# EAGLE design VIC20_SExpII (EAGLE 9.6.2)
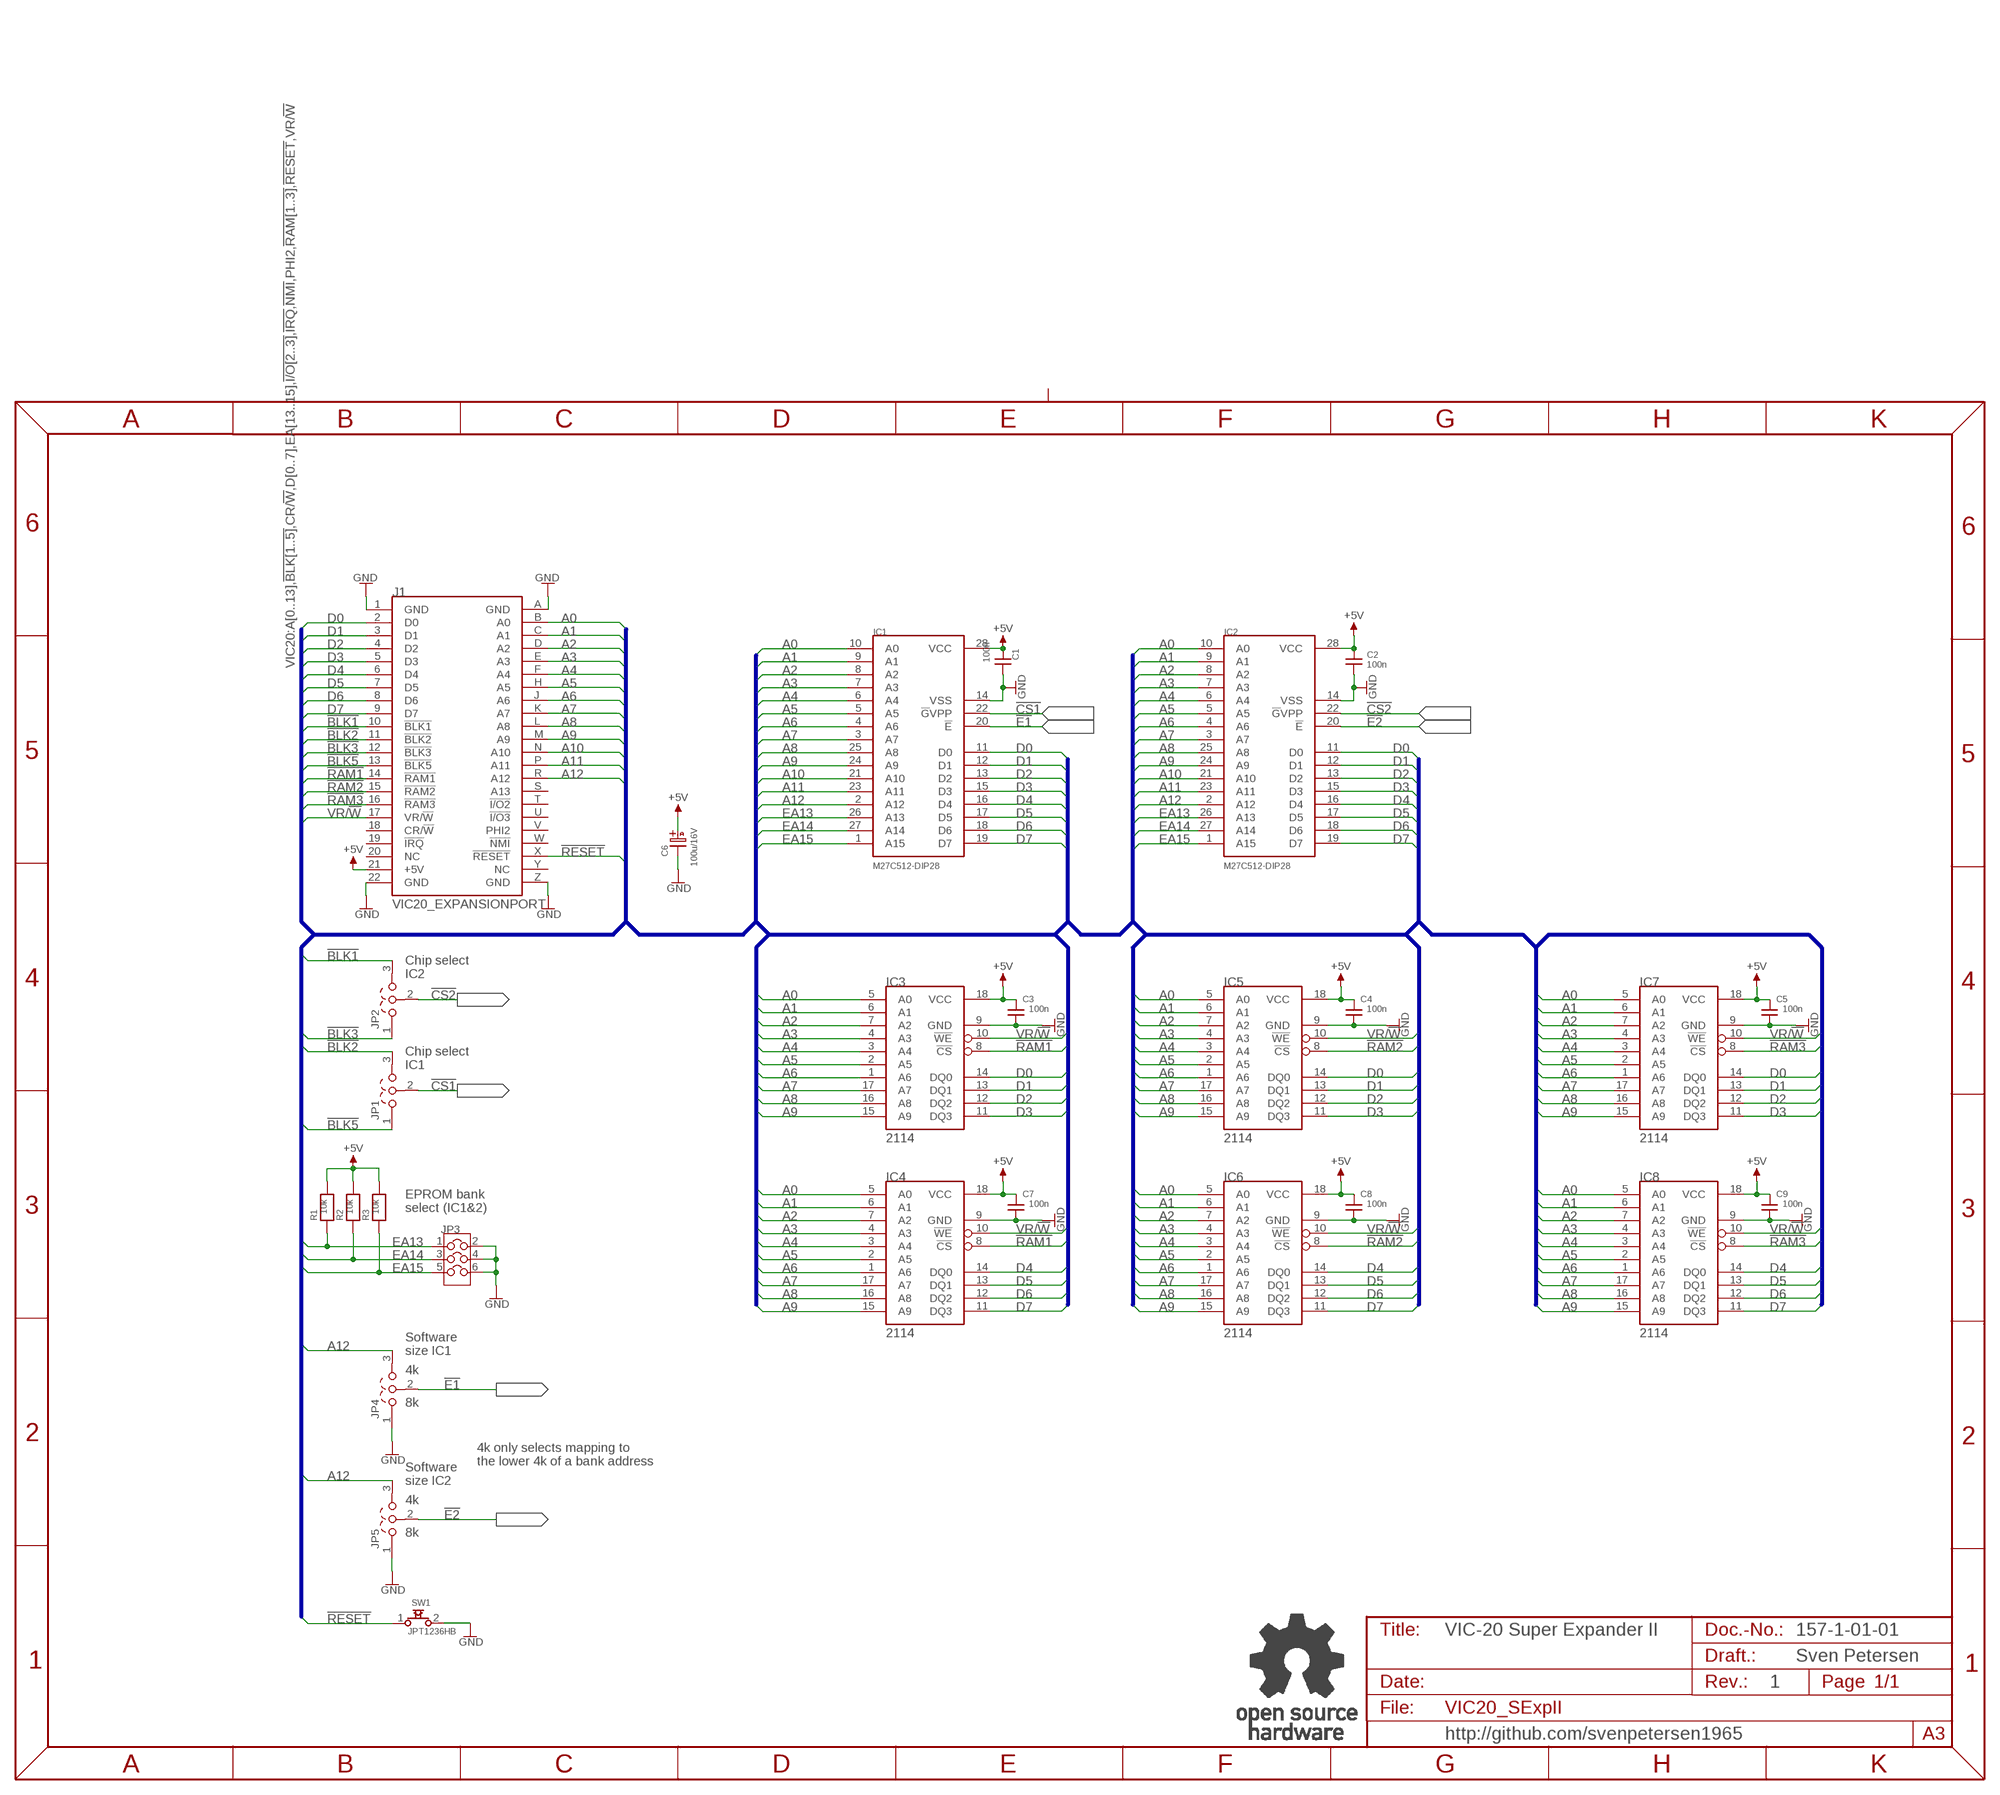
[diagram p0: schematic, sheet 1]

## Parts
C1  100n  CAP01  [C-2,5]
C2  100n  CAP01  [C-2,5]
C3  100n  CAP01  [C-2,5]
C4  100n  CAP01  [C-2,5]
C5  100n  CAP01  [C-2,5]
C6  100u/16V  C07/2,5  [C07/2,5]
C7  100n  CAP01  [C-2,5]
C8  100n  CAP01  [C-2,5]
C9  100n  CAP01  [C-2,5]
IC1  M27C512-DIP28  [DIL28-6]
IC2  M27C512-DIP28  [DIL28-6]
IC3  2114  [DIL18]
IC4  2114  [DIL18]
IC5  2114  [DIL18]
IC6  2114  [DIL18]
IC7  2114  [DIL18]
IC8  2114  [DIL18]
J1  VIC20_EXPANSIONPORT  [VIC20_EXPANSION]
JP1  COMBI-3P  [COMBI-3P]
JP2  COMBI-3P  [COMBI-3P]
JP3  COMBI-3X2P  [COMBI-3X2]
JP4  COMBI-3P  [COMBI-3P]
JP5  COMBI-3P  [COMBI-3P]
R1  10k  RES04  [R-10]
R2  10k  RES04  [R-10]
R3  10k  RES04  [R-10]
SW1  JPT1236HB  [JTP_1236HB]
U$2  OPEN_SOURCE_HW  [OPENHW]

## Nets
!BLK1: J1.10(!BLK1) JP2.3
!BLK2: J1.11(!BLK2) JP1.3
!BLK3: J1.12(!BLK3) JP2.1
!BLK5: J1.13(!BLK5) JP1.1
!CS1: IC1.22(!G!VPP) JP1.2
!CS2: IC2.22(!G!VPP) JP2.2
!E1: IC1.20(!E) JP4.2
!E2: IC2.20(!E) JP5.2
!RAM1: IC3.8(!CS) IC4.8(!CS) J1.14(!RAM1)
!RAM2: IC5.8(!CS) IC6.8(!CS) J1.15(!RAM2)
!RAM3: IC7.8(!CS) IC8.8(!CS) J1.16(!RAM3)
!RESET: J1.X(!RESET) SW1.1
+5V: C1.1 C2.1 C3.2 C4.2 C5.2 C6.A(+) C7.2 C8.2 C9.2 IC1.28(VCC) IC2.28(VCC) IC3.18(VCC) IC4.18(VCC) IC5.18(VCC) IC6.18(VCC) IC7.18(VCC) IC8.18(VCC) J1.21(+5V) R1.2 R2.2 R3.2
A0: IC1.10(A0) IC2.10(A0) IC3.5(A0) IC4.5(A0) IC5.5(A0) IC6.5(A0) IC7.5(A0) IC8.5(A0) J1.B(A0)
A1: IC1.9(A1) IC2.9(A1) IC3.6(A1) IC4.6(A1) IC5.6(A1) IC6.6(A1) IC7.6(A1) IC8.6(A1) J1.C(A1)
A2: IC1.8(A2) IC2.8(A2) IC3.7(A2) IC4.7(A2) IC5.7(A2) IC6.7(A2) IC7.7(A2) IC8.7(A2) J1.D(A2)
A3: IC1.7(A3) IC2.7(A3) IC3.4(A3) IC4.4(A3) IC5.4(A3) IC6.4(A3) IC7.4(A3) IC8.4(A3) J1.E(A3)
A4: IC1.6(A4) IC2.6(A4) IC3.3(A4) IC4.3(A4) IC5.3(A4) IC6.3(A4) IC7.3(A4) IC8.3(A4) J1.F(A4)
A5: IC1.5(A5) IC2.5(A5) IC3.2(A5) IC4.2(A5) IC5.2(A5) IC6.2(A5) IC7.2(A5) IC8.2(A5) J1.H(A5)
A6: IC1.4(A6) IC2.4(A6) IC3.1(A6) IC4.1(A6) IC5.1(A6) IC6.1(A6) IC7.1(A6) IC8.1(A6) J1.J(A6)
A7: IC1.3(A7) IC2.3(A7) IC3.17(A7) IC4.17(A7) IC5.17(A7) IC6.17(A7) IC7.17(A7) IC8.17(A7) J1.K(A7)
A8: IC1.25(A8) IC2.25(A8) IC3.16(A8) IC4.16(A8) IC5.16(A8) IC6.16(A8) IC7.16(A8) IC8.16(A8) J1.L(A8)
A9: IC1.24(A9) IC2.24(A9) IC3.15(A9) IC4.15(A9) IC5.15(A9) IC6.15(A9) IC7.15(A9) IC8.15(A9) J1.M(A9)
A10: IC1.21(A10) IC2.21(A10) J1.N(A10)
A11: IC1.23(A11) IC2.23(A11) J1.P(A11)
A12: IC1.2(A12) IC2.2(A12) J1.R(A12) JP4.3 JP5.3
D0: IC1.11(D0) IC2.11(D0) IC3.14(DQ0) IC5.14(DQ0) IC7.14(DQ0) J1.2(D0)
D1: IC1.12(D1) IC2.12(D1) IC3.13(DQ1) IC5.13(DQ1) IC7.13(DQ1) J1.3(D1)
D2: IC1.13(D2) IC2.13(D2) IC3.12(DQ2) IC5.12(DQ2) IC7.12(DQ2) J1.4(D2)
D3: IC1.15(D3) IC2.15(D3) IC3.11(DQ3) IC5.11(DQ3) IC7.11(DQ3) J1.5(D3)
D4: IC1.16(D4) IC2.16(D4) IC4.14(DQ0) IC6.14(DQ0) IC8.14(DQ0) J1.6(D4)
D5: IC1.17(D5) IC2.17(D5) IC4.13(DQ1) IC6.13(DQ1) IC8.13(DQ1) J1.7(D5)
D6: IC1.18(D6) IC2.18(D6) IC4.12(DQ2) IC6.12(DQ2) IC8.12(DQ2) J1.8(D6)
D7: IC1.19(D7) IC2.19(D7) IC4.11(DQ3) IC6.11(DQ3) IC8.11(DQ3) J1.9(D7)
EA13: IC1.26(A13) IC2.26(A13) JP3.1 R1.1
EA14: IC1.27(A14) IC2.27(A14) JP3.3 R2.1
EA15: IC1.1(A15) IC2.1(A15) JP3.5 R3.1
GND: C1.2 C2.2 C3.1 C4.1 C5.1 C6.K(-) C7.1 C8.1 C9.1 IC1.14(VSS) IC2.14(VSS) IC3.9(GND) IC4.9(GND) IC5.9(GND) IC6.9(GND) IC7.9(GND) IC8.9(GND) J1.1(GND) J1.22(GND) J1.A(GND) J1.Z(GND) JP3.2 JP3.4 JP3.6 JP4.1 JP5.1 SW1.2
VR/!W: IC3.10(!WE) IC4.10(!WE) IC5.10(!WE) IC6.10(!WE) IC7.10(!WE) IC8.10(!WE) J1.17(VR/!W)
Unconnected: J1.18(CR/!W) J1.19(!IRQ) J1.S(A13) J1.T(!I/O2) J1.U(!I/O3) J1.V(PHI2) J1.W(!NMI) J1.Y(NC)

## Buses
VIC20:A[0..13],!BLK[1..5],CR/!W,D[0..7],EA[13..15],!I/O[2..3],!IRQ,!NMI,PHI2,!RAM[1..3],!RESET,VR/!W

## Notes on the sheet
- Chip select
  IC2
- Chip select
  IC1
- EPROM bank
  select (IC1&2)
- Software
  size IC1
- 4k
- 8k
- 4k only selects mapping to
  the lower 4k of a bank address
- Software
  size IC2
- 4k
- 8k
- VIC-20 Super Expander II | 157-1-01-01
- Sven Petersen
- 1
- http://github.com/svenpetersen1965

## Power pins joined to a net without a drawn wire
NC: J1.20(NC)

## Library data of the parts
C1-C5 C7-C9 = DISCRETE:CAP01
C6 = ELCO:C07/2,5
IC1 IC2 = ST:M27C512
IC3-IC8 = MOS:2114
J1 = Commodore:VIC20_EXPANSIONPORT
JP1 JP2 JP4 JP5 = Cutpad:COMBI-3P
JP3 = Cutpad:COMBI-3X2P
R1-R3 = DISCRETE:RES04
SW1 = Namae_Electronics:JPT1236HB
U$2 = Logo:OPEN_SOURCE_HW

## Board
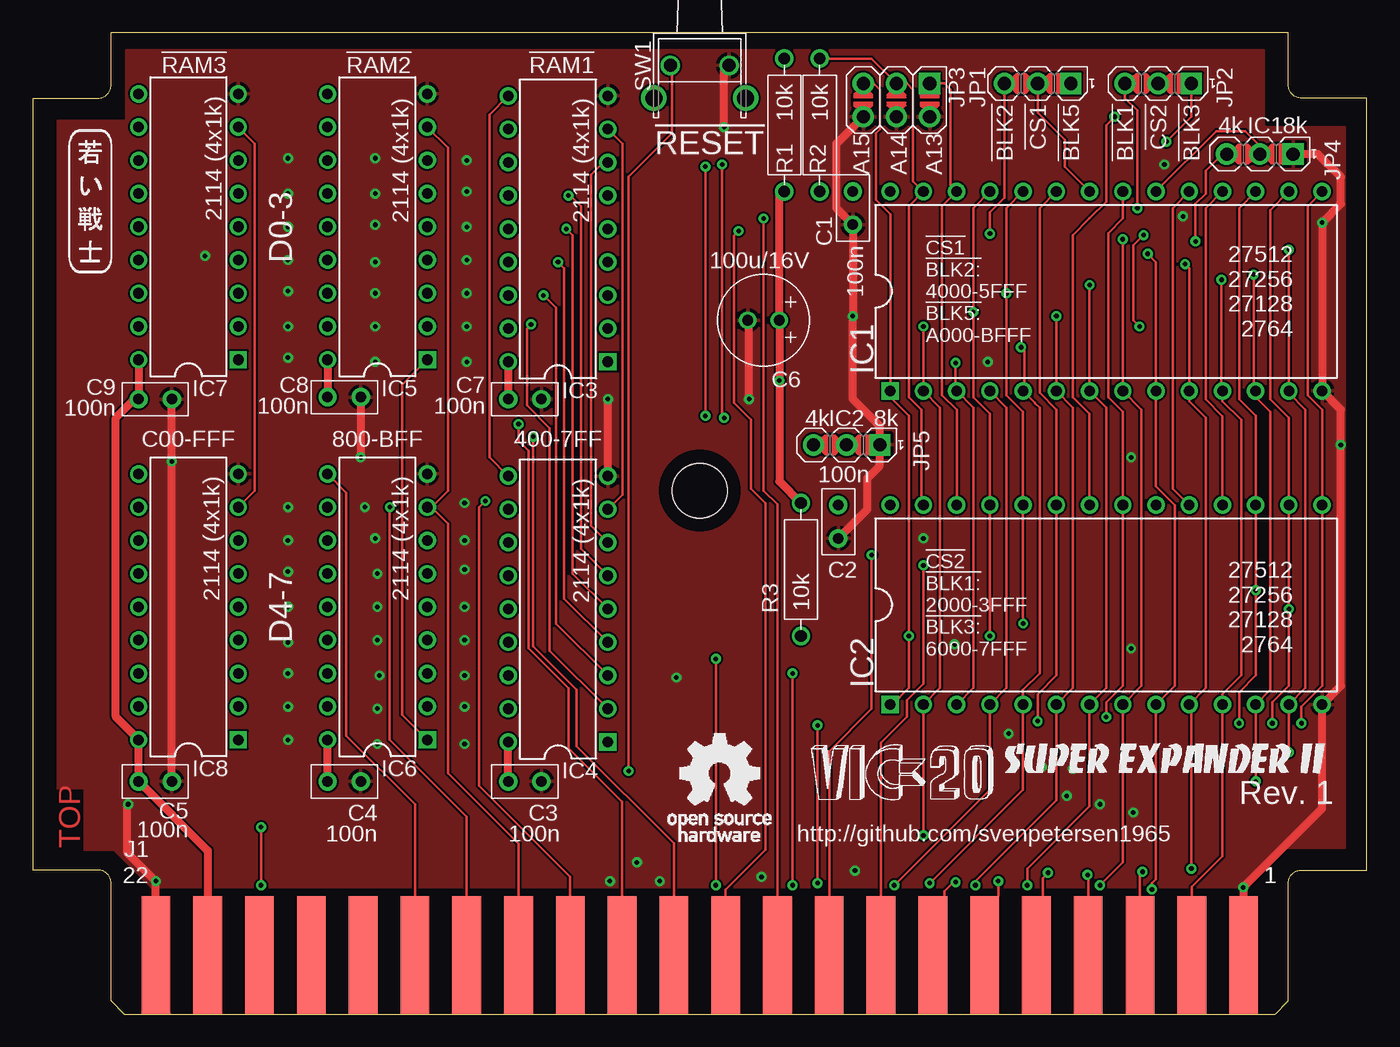
[diagram p1: board, top side]
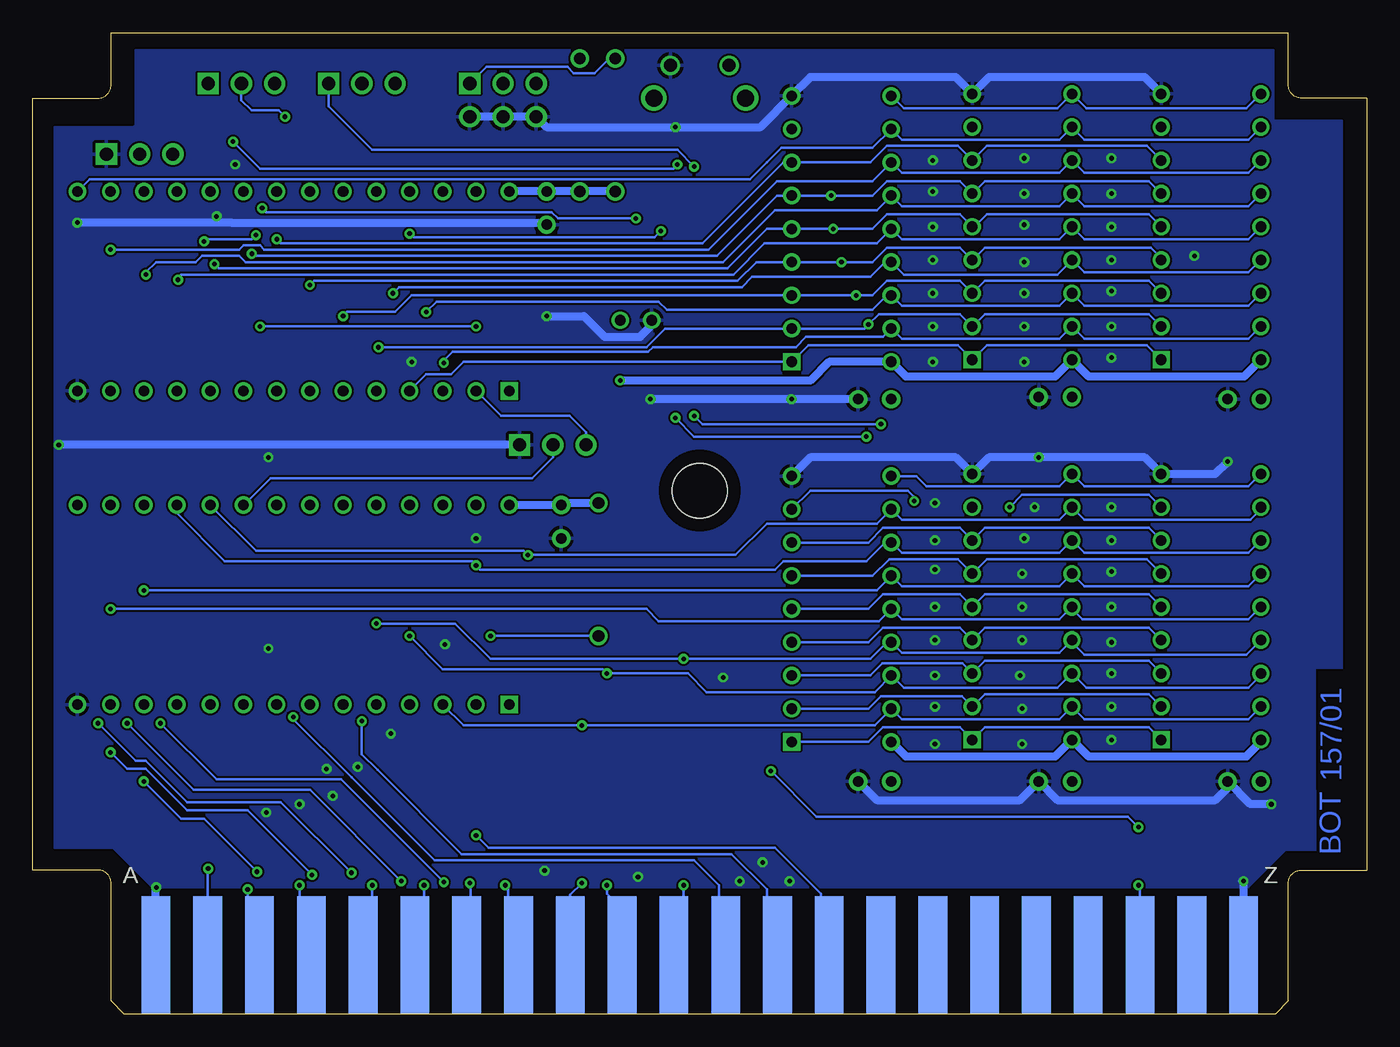
[diagram p2: board, bottom side, seen from below]

Size 102 x 75 mm. Coordinates in mm from the lower left corner, seen from the top.
Outline: 102,11 102,70 97,70 arc-90 96,71 96,75 6,75 6,71 arc-90 5,70 0,70 0,11
Copper layers (1*16): Top 0.035mm / dielectric 1.5mm / Bottom 0.035mm
Design rules "default *": minimum track width 6mil, minimum drill 0.35mm, track to track 6mil, track to pad 6mil, pad to pad 6mil, via to via 6mil, smd to smd 6mil, copper to edge 40mil, drill to drill 6mil, minimum pad ring 10mil, minimum via ring 8mil, stop-mask expansion 4mil, vias tented up to drill 23mil, thermal gap 10mil
Holes 4.2 mm at 51,40
bRestrict: 2 lines

### Footprints (pad centres in the part's own frame; a part is rotated, then mirrored left to right if it is on the bottom)
C-2,5 = drill 0.8 pad 1.397: 1 -1.27,0; 2 1.27,0
C07/2,5 = drill 0.813 pad 1.27: A -1.202,0; K 1.202,0
DIL28-6 = drill 0.813 square: 1 -16.51,-7.62 | drill 0.813: 2 -13.97,-7.62; 3 -11.43,-7.62; 4 -8.89,-7.62; 5 -6.35,-7.62; 6 -3.81,-7.62; 7 -1.27,-7.62; 8 1.27,-7.62; 9 3.81,-7.62; 10 6.35,-7.62; 11 8.89,-7.62; 12 11.43,-7.62; 13 13.97,-7.62; 14 16.51,-7.62; 15 16.51,7.62; 16 13.97,7.62; 17 11.43,7.62; 18 8.89,7.62; 19 6.35,7.62; 20 3.81,7.62; 21 1.27,7.62; 22 -1.27,7.62; 23 -3.81,7.62; 24 -6.35,7.62; 25 -8.89,7.62; 26 -11.43,7.62; 27 -13.97,7.62; 28 -16.51,7.62
DIL18 = drill 0.813 square: 1 -10.16,-3.81 | drill 0.813: 2 -7.62,-3.81; 3 -5.08,-3.81; 4 -2.54,-3.81; 5 0,-3.81; 6 2.54,-3.81; 7 5.08,-3.81; 8 7.62,-3.81; 9 10.16,-3.81; 10 10.16,3.81; 11 7.62,3.81; 12 5.08,3.81; 13 2.54,3.81; 14 0,3.81; 15 -2.54,3.81; 16 -5.08,3.81; 17 -7.62,3.81; 18 -10.16,3.81
VIC20_EXPANSION = smd 2.2 x 9: 1 41.58,4.5; 2 37.62,4.5; 3 33.66,4.5; 4 29.7,4.5; 5 25.74,4.5; 6 21.78,4.5; 7 17.82,4.5; 8 13.86,4.5; 9 9.9,4.5; 10 5.94,4.5; 11 1.98,4.5; 12 -1.98,4.5; 13 -5.94,4.5; 14 -9.9,4.5; 15 -13.86,4.5; 16 -17.82,4.5; 17 -21.78,4.5; 18 -25.74,4.5; 19 -29.7,4.5; 20 -33.66,4.5; 21 -37.62,4.5; 22 -41.58,4.5 | smd 2.2 x 9 bottom: A 41.58,4.5; B 37.62,4.5; C 33.66,4.5; D 29.7,4.5; E 25.74,4.5; F 21.78,4.5; H 17.82,4.5; J 13.86,4.5; K 9.9,4.5; L 5.94,4.5; M 1.98,4.5; N -1.98,4.5; P -5.94,4.5; R -9.9,4.5; S -13.86,4.5; T -17.82,4.5; U -21.78,4.5; V -25.74,4.5; W -29.7,4.5; X -33.66,4.5; Y -37.62,4.5; Z -41.58,4.5
COMBI-3P = drill 1 pad 1.626 square: 1 -2.54,0 | drill 1 pad 1.626: 2 0,0; 3 2.54,0
COMBI-3X2 = drill 1 pad 1.626 square: 1 -1.27,2.54 | drill 1 pad 1.626: 2 1.27,2.54; 3 -1.27,0; 4 1.27,0; 5 -1.27,-2.54; 6 1.27,-2.54
R-10 = drill 0.889 pad 1.397: 1 -5.08,0; 2 5.08,0
JTP_1236HB = drill 1: 1 2.25,0; 2 -2.25,0 | drill 1.3: CS1 3.5,2.5; CS2 -3.5,2.5

### Placement (x,y rotation side)
C1  62.71,61.59 270 top
C2  61.59,37.62 270 top
C3  37.62,17.78 180 top
C4  23.81,17.78 180 top
C5  9.37,17.78 180 top
C6  55.88,53.02 180 top
C7  37.62,46.99 180 top
C8  23.81,47.15 180 top
C9  9.37,46.99 180 top
IC1  82.07,55.24 0 top
IC2  82.07,31.27 0 top
IC3  40.16,60.01 90 top
IC4  40.16,30.96 90 top
IC5  26.35,60.17 90 top
IC6  26.35,31.11 90 top
IC7  11.91,60.17 90 top
IC8  11.91,31.11 90 top
J1  51,0 0 top
JP1  76.83,71.12 180 top
JP2  86.04,71.12 180 top
JP3  66.04,69.85 270 top
JP4  93.82,65.72 180 top
JP5  62.23,43.5 180 top
R1  57.47,67.94 270 top
R2  60.17,67.94 270 top
R3  58.74,33.97 90 top
SW1  51,72.5 180 top
U$2  48.58,13.18 0 top
U$15  [SVEN_TAG]  4.45,62.23 0 top
U$16  [2LAYER]  3.65,12.7 90 top
U$40  [PCB-TITLE/]  0,87 0 top  (outside the outline)
U$42  [SUPER_EXPANDER]  74.3,18.41 0 top
U$43  [VIC-20]  59.53,16.35 0 top

### Tracks (layer width: path | path; a pad name or v marks a point on that pad's centre or on a via)
!BLK1  (via drill 0.35)
  Top 0.203: J1.10 56.94,38.95 55.88,40.01 v55.88,60.8 | v84.45,61.59 84.45,69.06 83.5,70.01 JP2.3
  Bottom 0.203: v55.88,60.8 61.84,60.8 62.31,61.28 84.14,61.28 v84.45,61.59
!BLK2  (via drill 0.35)
  Top 0.203: J1.11 52.98,9.48 56.04,12.54 56.04,39.05 54.93,40.16 54.93,45.4 53.6,46.73 53.6,59.48 v53.98,59.85 | v73.18,59.65 73.18,61.28 74.3,62.39 JP1.3
  Bottom 0.203: v53.98,59.85 54.45,59.37 72.87,59.37 73.18,59.69 v73.18,59.65
!BLK3  (via drill 0.35)
  Top 0.203: J1.12 49.02,13.05 41.59,20.48 41.59,24.77 38.26,28.1 v38.26,44.13 | v52.7,64.93 52.7,45.72 v52.86,45.56 | v86.68,66.67 88.58,68.58 JP2.1
  Bottom 0.203: v38.26,44.13 51.44,44.13 v52.86,45.56 | v52.7,64.93 53.02,64.61 84.61,64.61 v86.68,66.67
!BLK5  (via drill 0.35)
  Top 0.203: J1.13 45.06,16.22 40.96,20.32 40.96,24.9 37.9,27.95 37.9,43.06 37.15,43.81 v37.15,45.09 | v51.44,45.72 v51.44,64.77
  Bottom 0.203: v37.15,45.09 50.8,45.09 v51.44,45.72 | v51.44,64.77 52.7,66.04 76.04,66.04 79.38,69.37 JP1.1
!CS1
  Top 0.203: IC1.22 78.9,64.77 78.9,66.83 76.83,68.9 JP1.2
!CS2  (via drill 0.35)
  Top 0.203: IC2.22 80.8,45.88 79.53,47.15 79.53,59.53 80.8,60.8 82.07,62.07 82.07,63.34 82.07,67.94 v82.71,68.58
  Bottom 0.203: v82.71,68.58 83.19,69.06 85.25,69.06 86.04,69.85 JP2.2
!E1
  Top 0.203: IC1.20 90.49,67.47 92.71,67.47 93.82,66.36 JP4.2
!E2
  Bottom 0.203: JP5.2 62.23,42.55 63.82,40.96 83.82,40.96 IC2.20
!RAM1  (via drill 0.35)
  Top 0.203: IC4.8 45.08,39.69 45.08,41.33 45.09,41.33 45.09,66.52 IC3.8 | J1.14 41.1,10.49 34.13,17.46 34.13,38.73 v34.61,39.21
  Bottom 0.203: v34.61,39.21 34.61,39.53 35.08,40.01 42.55,40.01 IC4.8
!RAM2
  Top 0.203: IC5.8 31.75,66.2 31.75,40.01 30.48,38.73 | 30.48,38.73 IC6.8 30.48,38.73 | J1.15 37.14,13.03 31.75,18.41 31.75,37.47 30.48,38.73
!RAM3  (via drill 0.35)
  Top 0.203: J1.16 33.18,15.08 27.3,20.95 v27.3,38.73 | IC8.8 16.99,40.01 16.99,66.52 IC7.8
  Bottom 0.203: v27.3,38.73 26.35,39.69 16.67,39.69 IC8.8
!RESET  (via drill 0.35)
  Top 0.203: v17.46,9.84 v17.46,14.29 | v45.56,18.57 45.56,63.98 48.9,67.31 48.9,72.36 SW1.1
  Bottom 0.203: J1.X 17.34,9.72 v17.46,9.84 | v17.46,14.29 18.26,15.08 42.07,15.08 v45.56,18.57
+5V  (via drill 0.35)
  Top 0.61: R1.2 57.08,62.48 C6.A v57.08,48.42 57.08,40.71 R3.2 | IC3.18 C7.2 | IC5.18 C8.2 | IC7.18 C9.2 7.78,46.99 6.35,45.56 6.35,22.7 IC8.18 C5.2 13.38,12.5 J1.21 | C4.2 IC6.18 | C3.2 IC4.18
  Bottom 0.61: IC7.18 9.37,48.74 21.27,48.74 IC5.18 23.81,48.74 35.24,48.74 IC3.18 41.12,49.85 42.55,48.42 v57.08,48.42 | IC4.18 35.24,19.68 23.81,19.68 IC6.18 21.27,19.68 9.21,19.68 8.1,20.8 IC8.18 | R1.2 R2.2 C1.1 IC1.28 | v57.08,48.42 57.15,48.42 v57.08,48.42 | R3.2 61.44,39.05 C2.1 IC2.28
A0  (via drill 0.35)
  Top 0.203: v88.11,57.31 88.42,56.99 IC1.10 88.42,46.83 89.69,45.56 89.69,24.92 IC2.10 88.58,23.5 v88.58,11.11 | IC4.5 41.27,33.66 41.27,59.53 v40.8,60.01
  Bottom 0.203: IC7.5 16.67,61.12 29.05,61.12 30,60.17 IC5.5 31.11,61.12 36.67,61.12 37.78,60.01 v40.8,60.01 IC3.5 45.88,60.01 48.9,56.99 87.79,56.99 v88.11,57.31 | IC4.5 38.1,30.96 36.99,32.07 31.11,32.07 IC6.5 29.21,32.07 16.67,32.07 IC8.5 | J1.B 88.62,11.07 v88.58,11.11
A1  (via drill 0.35)
  Top 0.203: v85.25,58.1 85.88,57.47 IC1.9 85.88,40.32 87.31,38.89 87.31,25.08 IC2.9 85.88,10.32 85.57,10 v85.57,9.53 | IC4.6 41.91,35.56 41.91,61.75 41.12,62.55 v40.96,62.55
  Bottom 0.203: IC7.6 16.67,63.66 29.21,63.66 IC5.6 31.11,63.66 36.67,63.66 37.78,62.55 v40.96,62.55 IC3.6 45.09,62.55 49.69,57.94 85.09,57.94 v85.25,58.1 | IC4.6 37.78,33.5 36.51,34.77 31.27,34.77 IC6.6 29.05,34.77 16.83,34.77 IC8.6 | v85.57,9.53 85.57,5.41 J1.C
A2  (via drill 0.35)
  Top 0.203: v83.34,59.21 IC1.8 84.77,46.2 84.77,25.08 IC2.8 83.34,11.59 v81.6,9.84 | IC4.7 42.7,37.31 42.7,64.14 43.66,65.09 IC3.7
  Bottom 0.203: IC7.7 16.83,66.36 29.05,66.36 IC5.7 31.27,66.36 36.67,66.36 37.94,65.09 IC3.7 44.61,65.09 50.8,58.9 83.03,58.9 v83.34,59.21 | IC4.7 38.1,36.04 36.99,37.15 31.11,37.15 IC6.7 29.21,37.15 16.67,37.15 IC8.7 | v81.6,9.84 81.6,5.4 J1.D
A3  (via drill 0.35)
  Top 0.203: v80.8,55.72 IC1.7 82.07,46.35 82.07,24.92 IC2.7 80.8,15.88 76.04,11.11 v76.04,9.84 | IC4.4 40.64,31.75 40.64,56.99 v40.16,57.47
  Bottom 0.203: IC7.4 15.72,57.78 16.51,58.58 29.21,58.58 IC5.4 31.11,58.58 36.67,58.58 37.78,57.47 v40.16,57.47 IC3.4 46.67,57.47 48.1,56.04 80.49,56.04 v80.8,55.72 | IC4.4 38.1,28.42 36.99,29.53 31.11,29.53 IC6.4 29.21,29.53 16.67,29.53 IC8.4 | v76.04,9.84 76.04,5.2 J1.E
A4  (via drill 0.35)
  Top 0.203: v78.26,53.34 IC1.6 79.53,46.35 79.53,24.92 IC2.6 78.26,16.35 72.07,10.16 v72.07,9.84 | IC4.3 40.01,29.84 40.01,53.98 v39.05,54.93
  Bottom 0.203: IC7.3 16.67,56.04 29.21,56.04 IC5.3 31.11,56.04 36.67,56.04 37.78,54.93 v39.05,54.93 IC3.3 56.99,54.93 73.03,54.93 74.3,53.66 77.95,53.66 v78.26,53.34 | IC4.3 37.94,25.88 37.03,26.79 30.92,26.79 IC6.3 29.21,26.99 16.67,26.99 IC8.3 | J1.F 72.07,5.21 v72.07,9.84
A5  (via drill 0.35)
  Top 0.203: 75.8,47.55 76.64,46.71 76.64,46.68 76.99,46.33 76.99,26.04 75.72,24.77 IC2.5 75.72,17.14 v68.58,10 | 75.8,47.55 IC1.5 | v75.56,50.96 75.8,50.72 75.8,47.55 | IC4.2 39.53,27.78 39.53,44.77 37.78,46.51 37.78,52.39 v38.1,52.7
  Bottom 0.203: IC7.2 16.67,53.5 29.21,53.5 IC5.2 31.11,53.5 37.31,53.5 v38.1,52.7 38.42,52.39 IC3.2 53.66,52.39 55.09,50.96 v75.56,50.96 | IC4.2 38.1,23.34 37.15,24.29 30.96,24.29 IC6.2 29.21,24.45 16.67,24.45 IC8.2 | J1.H 68.5,4.82 68.5,9.92 v68.58,10
A6  (via drill 0.35)
  Top 0.203: IC1.4 74.45,46.35 74.45,24.92 IC2.4 73.18,17.14 v65.88,9.84 | IC6.1 28.26,22.86 28.26,48.1 IC5.1
  Bottom 0.203: IC7.1 16.83,51.12 29.05,51.12 IC5.1 31.27,51.12 42.7,51.12 IC3.1 69.06,49.85 70.01,48.9 71.91,48.9 IC1.4 | IC4.1 38.1,20.8 36.99,21.91 31.11,21.91 IC6.1 29.21,21.91 16.67,21.91 IC8.1 | v65.88,9.84 65.65,9.62 65.65,5.29 J1.J
A7  (via drill 0.35)
  Top 0.203: IC2.3 71.91,24.92 71.91,46.35 IC1.3 70.56,47.7 v70.56,49.77 | v60.01,10 v60.01,22.07
  Bottom 0.203: IC7.17 9.05,51.59 21.59,51.59 IC5.17 23.5,51.59 35.56,51.59 IC3.17 36.99,51.75 42.86,51.75 43.66,50.96 54.58,50.96 54.94,50.6 69.89,50.6 70.64,49.85 v70.56,49.77 | IC8.17 9.05,22.54 21.59,22.54 IC6.17 23.5,22.54 35.56,22.54 IC4.17 37.62,22.07 v60.01,22.07 69.06,22.07 IC2.3 | J1.K 60.9,9.11 v60.01,10
A8  (via drill 0.35)
  Top 0.203: IC1.25 71.91,61.59 v71.91,53.66 71.91,47.15 73.18,45.88 IC2.25 v73.18,28.89 | v58.1,9.84 v58.1,26.04
  Bottom 0.203: IC7.16 9.05,54.13 21.59,54.13 IC5.16 23.5,54.13 35.56,54.13 IC3.16 36.67,54.93 37.78,53.82 53.5,53.82 54.13,54.45 71.12,54.45 v71.91,53.66 | IC8.16 8.1,25.88 9.05,24.92 21.43,24.92 IC6.16 23.65,24.92 35.4,24.92 IC4.16 37.62,24.61 50.48,24.61 51.91,26.04 v58.1,26.04 58.42,26.35 70.64,26.35 v73.18,28.89 | J1.L 56.94,8.04 58.1,9.21 v58.1,9.84
A9  (via drill 0.35)
  Top 0.203: IC1.24 74.45,61.59 v74.45,55.09 74.45,47.31 75.72,46.04 IC2.24 v75.72,29.84 | v52.23,9.84 v52.23,27.15
  Bottom 0.203: IC7.15 9.05,56.67 21.59,56.67 IC5.15 23.65,56.52 35.4,56.52 IC3.15 36.83,57.47 37.94,56.36 46.99,56.36 47.78,55.56 73.98,55.56 v74.45,55.09 | IC8.15 9.21,27.46 21.59,27.46 22.54,28.42 IC6.15 23.5,27.62 35.56,27.62 IC4.15 36.67,28.42 37.94,27.15 v52.23,27.15 66.99,27.15 69.69,29.84 v75.72,29.84 | J1.M 52.23,5.25 v52.23,9.84
A10  (via drill 0.35)
  Top 0.203: IC1.21 83.34,60.8 82.23,59.69 82.23,47.15 83.34,46.04 IC2.21 83.34,25.08 82.07,23.81 v82.07,22.7
  Bottom 0.203: J1.N 49.53,5.01 49.53,9.84 51.44,11.75 71.28,11.75 77.63,18.1 82.07,22.54 v82.07,22.7
A11  (via drill 0.35)
  Top 0.203: IC1.23 76.99,61.59 76.99,47.47 78.26,46.2 IC2.23 78.26,25.88 76.83,24.45 v76.83,22.38
  Bottom 0.203: J1.P 45.88,5.32 45.88,9.53 48.58,12.22 69.22,12.22 75.64,18.65 76.83,19.84 v76.83,22.38
A12  (via drill 0.35)
  Top 0.203: v68.1,13.65 IC2.2 69.37,24.92 69.37,46.35 IC1.2 v68.1,52.55 | v84.61,52.55 84.14,53.02 84.14,58.74 v84.93,59.53 | v88.9,59.05 88.9,60.33 88.9,61.91 89.69,62.71 89.69,64.45 90.96,65.72 JP4.3
  Bottom 0.203: J1.R 41.75,5.15 41.75,9.21 45.24,12.7 67.15,12.7 v68.1,13.65 | JP5.3 59.69,44.45 60.96,45.72 66.2,45.72 IC1.2 | v68.1,52.55 v84.61,52.55 | v84.93,59.53 85.25,59.21 88.9,59.21 v88.9,59.05
D0  (via drill 0.35)
  Top 0.203: J1.2 88.62,9.72 90.96,12.06 IC2.11 90.96,24.45 92.39,25.88 92.39,45.4 90.96,46.83 IC1.11 90.88,47.7 v90.88,56.12
  Bottom 0.203: IC7.14 9.05,59.21 21.59,59.21 IC5.14 23.5,59.21 35.56,59.21 IC3.14 37.47,58.9 46.04,58.9 48.42,56.52 90.65,56.52 90.96,56.2 v90.88,56.12
D1  (via drill 0.35)
  Top 0.203: v93.34,56.52 93.34,47.78 IC1.12 93.5,47.15 94.61,46.04 94.61,24.77 IC2.12 v93.5,17.78 | J1.3 84.66,10.52 84.93,10.79 v84.85,10.87
  Bottom 0.203: IC7.13 9.05,61.75 21.59,61.75 IC5.13 23.5,61.75 35.56,61.75 IC3.13 37.47,61.44 45.24,61.44 49.21,57.47 85.72,57.47 86.2,57.94 89.06,57.94 89.53,57.47 92.55,57.47 93.34,56.67 v93.34,56.52 | v84.85,10.87 88.9,14.92 90.65,14.92 v93.5,17.78
D2  (via drill 0.35)
  Top 0.203: v96.04,58.42 IC1.13 96.04,47.47 97.31,46.2 97.31,24.92 IC2.13 96.04,20.16 v96.04,20 | J1.4 80.7,10.58 v80.64,10.64
  Bottom 0.203: IC7.12 9.05,64.29 21.59,64.29 IC5.12 23.5,64.29 35.56,64.29 IC3.12 37.78,63.66 45.09,63.66 50.32,58.42 84.3,58.42 84.61,58.74 85.88,58.74 86.2,58.42 v96.04,58.42 | v80.64,10.64 85.57,15.56 90.17,15.56 93.34,18.73 94.77,18.73 v96.04,20
D3  (via drill 0.35)
  Top 0.203: IC1.15 97.47,61.75 97.47,47.31 98.58,46.2 IC2.15 98.58,25.08 97,23.5 v97,22.23 | J1.5 77.22,4.98 77.22,10.38 v77.63,10.79
  Bottom 0.203: IC7.11 9.05,66.83 21.59,66.83 IC5.11 23.5,66.83 35.56,66.83 IC3.11 37.78,66.2 44.77,66.2 45.88,65.09 47.15,63.82 97.63,63.82 IC1.15 | v77.63,10.79 83.03,16.19 90.17,16.19 93.34,19.37 94.14,19.37 v97,22.23
D4  (via drill 0.35)
  Top 0.203: IC1.16 94.61,61.44 94.61,46.99 96.04,45.56 IC2.16 v96.04,30.96 96.04,25.08 94.77,23.81 v94.77,22.23 | J1.6 72.78,8.01 73.82,9.05 v73.82,10.16
  Bottom 0.203: IC8.14 9.05,30.16 21.75,30.16 22.54,30.96 IC6.14 23.5,30.16 35.56,30.16 IC4.14 37.31,30 54.13,30 55.09,30.96 95.57,30.96 v96.04,30.96 | v73.82,10.16 80.8,17.14 89.69,17.14 v94.77,22.23
D5  (via drill 0.35)
  Top 0.203: IC1.17 92.23,61.59 92.23,46.99 93.5,45.72 IC2.17 v93.5,32.38 93.5,25.88 92.23,24.61 v92.23,22.23 | J1.7 69.69,5.37 69.69,9.37 70.48,10.16 v70.56,10.08
  Bottom 0.203: IC8.13 9.05,32.7 21.59,32.7 IC6.13 23.5,32.7 35.56,32.7 IC4.13 37.47,32.38 v93.5,32.38 | v70.56,10.08 78.42,17.94 87.95,17.94 v92.23,22.23
D6  (via drill 0.35)
  Top 0.203: IC2.18 90.96,45.7 89.69,46.97 89.69,61.59 IC1.18 | J1.8 64.86,20.73 66.83,22.7 66.83,23.97 68.1,25.24 v68.1,34.29
  Bottom 0.203: IC8.12 9.05,35.24 21.59,35.24 IC6.12 23.5,35.24 35.56,35.24 IC4.12 36.83,36.04 38.26,34.61 44.61,34.61 45.24,33.97 67.79,33.97 v68.1,34.29 68.42,34.61 87.31,34.61 90.96,38.26 IC2.18
D7  (via drill 0.35)
  Top 0.203: IC1.19 87.15,61.59 87.15,40.16 IC2.19 | J1.9 60.9,20.1 64.14,23.34 v64.14,35.08
  Bottom 0.203: IC8.11 8.1,38.58 8.89,37.78 21.59,37.78 IC6.11 23.5,37.78 35.56,37.78 IC4.11 37.47,37.47 45.88,37.47 48.26,35.08 v64.14,35.08 64.45,35.4 84.93,35.4 IC2.19
EA13
  Top 0.203: IC2.26 70.64,46.2 69.53,47.31 69.53,61.75 IC1.26 70.17,63.34 70.17,70.64 69.69,71.12 JP3.1
  Bottom 0.203: R1.1 57.94,73.03 59.05,71.91 60.64,71.91 61.12,72.39 67.31,72.39 JP3.1
EA14
  Top 0.203: IC2.27 67.94,39.05 67.94,46.2 66.99,47.15 66.99,61.75 IC1.27 67.31,63.66 67.31,70.64 66.83,71.12 JP3.3 64.14,73.03 R2.1
EA15  (via drill 0.35)
  Top 0.203: IC2.1 65.72,23.65 66.99,24.92 v66.99,28.89 66.99,45.72 65.56,47.15 IC1.1 65.56,61.12 64.45,62.23 64.45,67.31 64.77,67.63 64.77,70.64 64.29,71.12 JP3.5
  Bottom 0.203: R3.1 v66.99,28.89
GND  (via drill 0.35)
  Top 0.61: JP3.6 61.44,66.52 61.44,61.59 C1.2 v62.71,53.34 62.71,46.99 64.77,44.93 64.77,43.74 64.67,43.65 64.67,43.43 64.77,43.34 64.77,41.91 63.82,40.96 63.82,38.58 C2.2 | v54.77,46.99 54.77,52.93 C6.K | IC4.9 v43.97,46.99 | C8.1 v25.08,42.55 | C9.1 v10.64,42.23 C5.1 | J1.A 92.55,4.53 v92.55,9.68 98.58,15.72 IC2.14 100.01,25.08 v100.01,43.5 100.01,46.2 IC1.14 v98.58,60.48 100.01,61.91 100.01,63.98 98.27,65.72 JP4.1 | J1.Z v9.42,10.16 7.2,12.38 7.2,15.98 7.25,16.03 v7.3,16.03 | v52.86,67.79 52.86,72.11 SW1.2
  Bottom 0.61: IC4.9 42.55,42.55 31.43,42.55 IC6.9 28.89,42.55 v25.08,42.55 16.99,42.55 IC8.9 11.59,41.27 v10.64,42.23 | IC7.9 16.99,71.6 28.89,71.6 IC5.9 31.43,71.6 42.55,71.6 IC3.9 46.35,67.79 v52.86,67.79 62.71,67.79 JP3.6 JP3.4 JP3.2 | C1.2 62.87,60.48 86.84,60.48 v98.58,60.48 | v62.71,53.34 59.85,53.34 58.26,51.75 55.56,51.75 54.68,52.64 C6.K | C7.1 v43.97,46.99 v54.77,46.99 | C3.1 37.47,16.35 26.51,16.35 C4.1 23.65,16.35 11.59,16.35 10.64,17.3 C5.1 8.89,16.03 v7.3,16.03 | J1.A 92.58,9.65 v92.55,9.68 | J1.Z 9.42,10.05 9.53,10.16 v9.42,10.16 | JP5.1 v100.01,43.5
  other vias: 62.87,10.95 46.2,11.59 84.14,15.4 81.6,16.03 79.06,16.67 70.48,28.26 49.21,25.72 19.53,20.95 19.53,23.5 19.53,26.04 19.53,28.42 19.53,31.11 19.53,33.81 19.53,36.2 19.53,38.73 25.4,38.73 26.19,36.35 26.35,33.66 26.35,31.11 26.35,28.57 26.51,25.88 26.35,23.34 26.35,20.64 33.02,20.64 33.02,23.5 33.02,25.88 33.02,28.57 33.02,31.11 33.02,33.97 33.02,36.2 33.02,39.05 19.53,50.16 19.53,52.55 19.53,55.24 19.53,57.63 19.53,60.17 19.53,62.71 19.53,65.41 26.19,65.41 26.19,62.71 26.19,60.33 26.19,57.47 26.19,55.09 26.19,52.55 26.19,49.85 33.18,49.85 33.18,52.55 33.18,55.09 33.18,57.63 33.18,60.17 33.18,62.87 33.18,65.25 13.18,57.94 86.52,64.93 74.61,21.43 77.15,18.89 44.13,10.16 47.94,10.16 79.53,18.73 68.1,36.35 83.98,42.55 83.98,27.94 87.95,60.96 73.03,49.85 55.72,10.48
  pour Top: 1.91,68.26 7.14,68.26 7.14,73.66 94.14,73.66 94.14,67.94 94.3,67.79 100.33,67.79 100.33,12.7 95.89,12.7 95.73,12.86 92.55,9.68 9.05,9.68 6.19,12.54 1.91,12.54
  pour Bottom: 1.91,68.26 7.14,68.26 7.14,73.66 94.14,73.66 94.14,67.94 94.3,67.79 100.33,67.79 100.33,12.7 95.89,12.7 92.87,9.68 91.6,9.68 9.05,9.68 6.19,12.54 1.91,12.54
VR/!W
  Top 0.203: IC3.10 34.92,68.74 34.92,42.55 IC4.10 | J1.17 29.22,16.02 23.97,21.27 23.97,39.85 IC6.10
  Bottom 0.203: IC3.10 35.4,69.22 23.65,69.22 IC5.10 21.43,69.22 9.21,69.22 IC7.10 | IC4.10 34.45,41.12 33.66,40.32 23.5,40.32 IC6.10 21.59,40.32 9.05,40.32 IC8.10

### Text on the board
Bottom: 157/01
tPlace: !RAM3 | !RAM2 | !RAM1 | 10k | 10k | !BLK2 | !CS1 | !BLK5 | !BLK1 | !CS2 | !BLK3 | 4k | IC1 | 8k | !RESET | A15 | A14 | A13 | 2114 (4x1k) | D0-3 | 2114 (4x1k) | 2114 (4x1k) | 100n | 100u/16V | !CS1 / !BLK2: / 4000-5FFF / !BLK5: / A000-BFFF | 27512 / 27256 / 27128 / 2764 | 100n | 100n | 100n | 4k | IC2 | 8k | C00-FFF | 800-BFF | 400-7FF | 100n | 2114 (4x1k) | 2114 (4x1k) | D4-7 | 2114 (4x1k) | 10k | !CS2 / !BLK1: / 2000-3FFF / !BLK3: / 6000-7FFF | 27512 / 27256 / 27128 / 2764 | Rev. 1 | 100n | 100n | 100n | http://github.com/svenpetersen1965
Document: 157-2-01-01 | Sven Petersen / 2021 | 35µm | 2 | 1